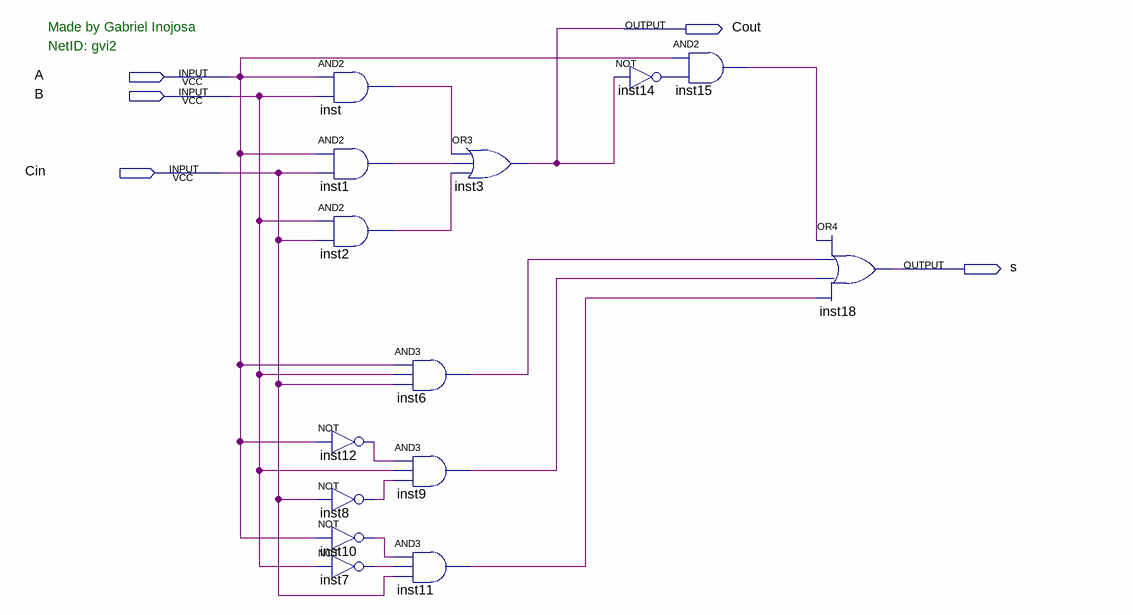
[diagram p0: schematic sheet]
// Quartus schematic Lab3assignment.bdf as structural Verilog: 14 symbols, 5 pins
module Lab3assignment (
  input  A,
  input  B,
  input  Cin,
  output Cout,
  output s
);

  wire inst1_out, inst2_out, inst6_out, inst7_out, inst8_out, inst9_out, inst10_out, inst11_out, inst12_out,
       inst14_out, inst15_out, inst_out;

  and inst (inst_out, A, B);
  and inst1 (inst1_out, A, Cin);
  and inst2 (inst2_out, B, Cin);
  not inst12 (inst12_out, A);
  not inst8 (inst8_out, Cin);
  not inst10 (inst10_out, A);
  not inst7 (inst7_out, B);
  or inst3 (Cout, inst_out, inst1_out, inst2_out);
  and inst6 (inst6_out, A, B, Cin);
  and inst9 (inst9_out, inst12_out, B, inst8_out);
  and inst11 (inst11_out, inst10_out, inst7_out, Cin);
  not inst14 (inst14_out, Cout);
  and inst15 (inst15_out, A, inst14_out);
  or inst18 (s, inst15_out, inst6_out, inst9_out, inst11_out);

  // Notes on the sheet:
  //   Made by Gabriel Inojosa
  //   NetID: gvi2
endmodule
